# Altium project relay_matrix.PrjPCB (part 2 of 2)

## Sheet drivers.SchDoc
size A4
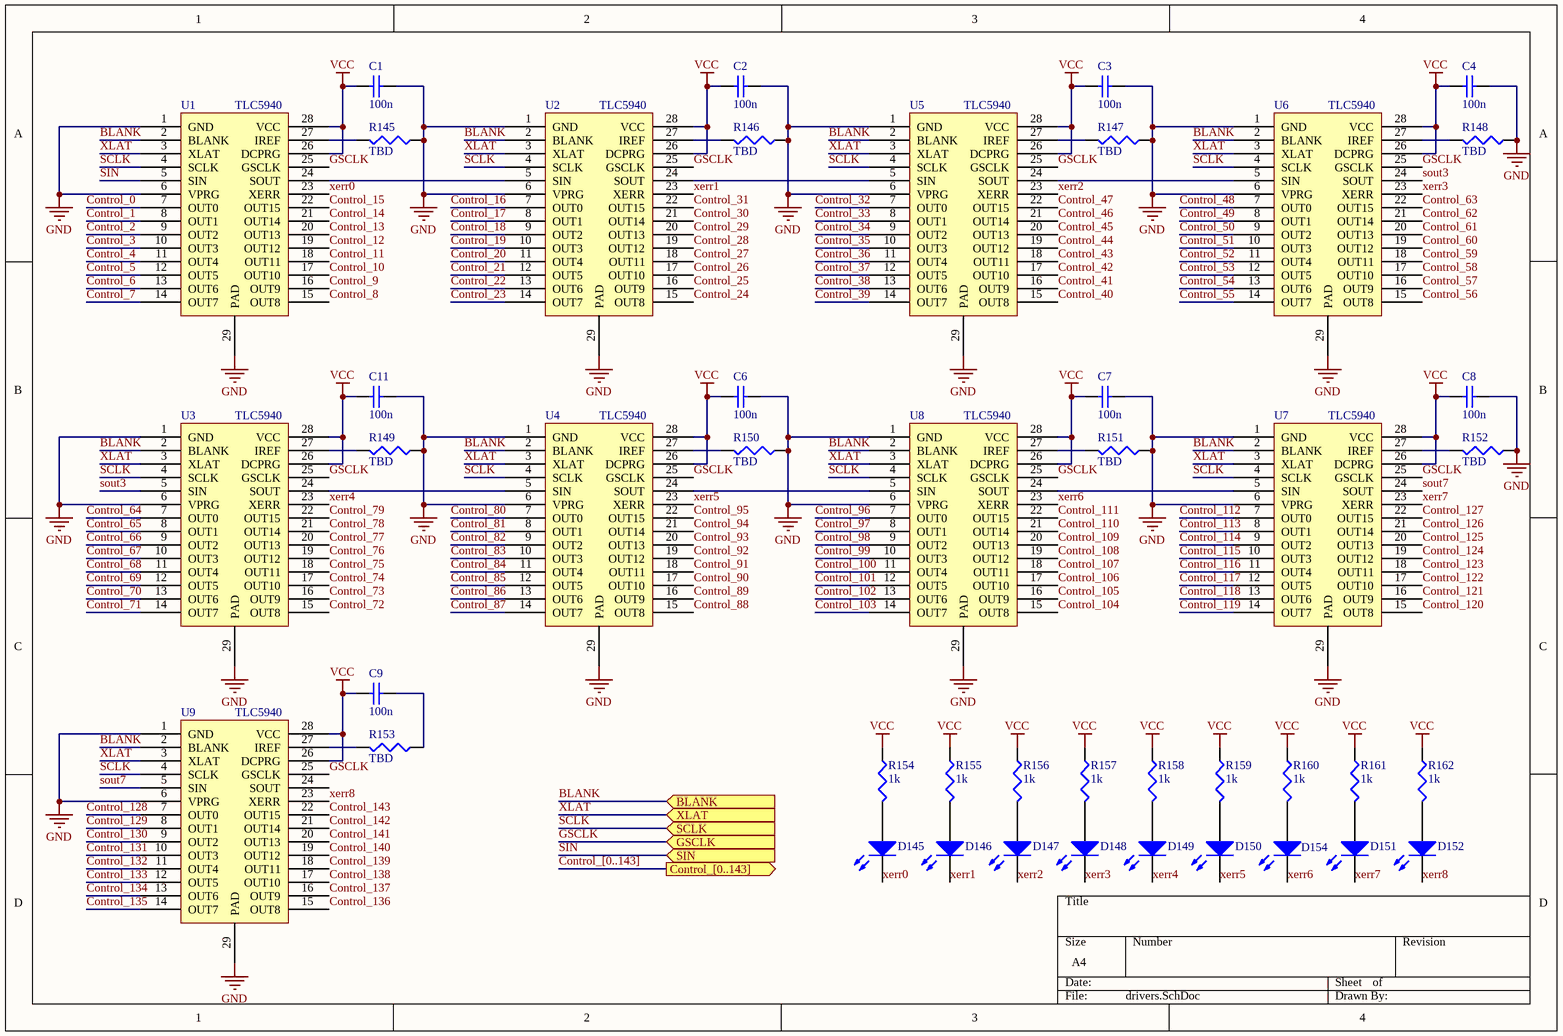
[diagram p5: drivers.SchDoc]

### Parts
C1  value 100n  [1608[0603]]  (hidden comment: Cap Semi)
C2  value 100n  [1608[0603]]  (hidden comment: Cap Semi)
C3  value 100n  [1608[0603]]  (hidden comment: Cap Semi)
C4  value 100n  [1608[0603]]  (hidden comment: Cap Semi)
C6  value 100n  [1608[0603]]  (hidden comment: Cap Semi)
C7  value 100n  [1608[0603]]  (hidden comment: Cap Semi)
C8  value 100n  [1608[0603]]  (hidden comment: Cap Semi)
C9  value 100n  [1608[0603]]  (hidden comment: Cap Semi)
C11  value 100n  [1608[0603]]  (hidden comment: Cap Semi)
D145  LED0  [J1-0603]  (value not drawn)
D146  LED0  [J1-0603]  (value not drawn)
D147  LED0  [J1-0603]  (value not drawn)
D148  LED0  [J1-0603]  (value not drawn)
D149  LED0  [J1-0603]  (value not drawn)
D150  LED0  [J1-0603]  (value not drawn)
D151  LED0  [J1-0603]  (value not drawn)
D152  LED0  [J1-0603]  (value not drawn)
D154  LED0  [J1-0603]  (value not drawn)
R145  value TBD  [J1-0603]  (hidden comment: Res3)
R146  value TBD  [J1-0603]  (hidden comment: Res3)
R147  value TBD  [J1-0603]  (hidden comment: Res3)
R148  value TBD  [J1-0603]  (hidden comment: Res3)
R149  value TBD  [J1-0603]  (hidden comment: Res3)
R150  value TBD  [J1-0603]  (hidden comment: Res3)
R151  value TBD  [J1-0603]  (hidden comment: Res3)
R152  value TBD  [J1-0603]  (hidden comment: Res3)
R153  value TBD  [J1-0603]  (hidden comment: Res3)
R154  value 1k  [J1-0603]  (hidden comment: Res3)
R155  value 1k  [J1-0603]  (hidden comment: Res3)
R156  value 1k  [J1-0603]  (hidden comment: Res3)
R157  value 1k  [J1-0603]  (hidden comment: Res3)
R158  value 1k  [J1-0603]  (hidden comment: Res3)
R159  value 1k  [J1-0603]  (hidden comment: Res3)
R160  value 1k  [J1-0603]  (hidden comment: Res3)
R161  value 1k  [J1-0603]  (hidden comment: Res3)
R162  value 1k  [J1-0603]  (hidden comment: Res3)
U1  TLC5940  [HTSSOP28]
U2  TLC5940  [HTSSOP28]
U3  TLC5940  [HTSSOP28]
U4  TLC5940  [HTSSOP28]
U5  TLC5940  [HTSSOP28]
U6  TLC5940  [HTSSOP28]
U7  TLC5940  [HTSSOP28]
U8  TLC5940  [HTSSOP28]
U9  TLC5940  [HTSSOP28]

### Ports
BLANK (in), Control_[0..143] (out), GSCLK (in), SCLK (in), SIN (in), XLAT (in)

### Nets
GND: C1.1 C2.1 C3.1 C4.1 C6.1 C7.1 C8.1 C11.1 R145.1 R146.1 R147.1 R148.1 R149.1 R150.1 R151.1 R152.1 U1.1(GND) U1.6(VPRG) U1.29(PAD) U2.1(GND) U2.6(VPRG) U2.29(PAD) U3.1(GND) U3.6(VPRG) U3.29(PAD) U4.1(GND) U4.6(VPRG) U4.29(PAD) U5.1(GND) U5.6(VPRG) U5.29(PAD) U6.1(GND) U6.6(VPRG) U6.29(PAD) U7.1(GND) U7.6(VPRG) U7.29(PAD) U8.1(GND) U8.6(VPRG) U8.29(PAD) U9.1(GND) U9.6(VPRG) U9.29(PAD)
VCC: C1.2 C2.2 C3.2 C4.2 C6.2 C7.2 C8.2 C9.2 C11.2 R154.1 R155.1 R156.1 R157.1 R158.1 R159.1 R160.1 R161.1 R162.1 U1.26(DCPRG) U1.28(VCC) U2.26(DCPRG) U2.28(VCC) U3.26(DCPRG) U3.28(VCC) U4.26(DCPRG) U4.28(VCC) U5.26(DCPRG) U5.28(VCC) U6.26(DCPRG) U6.28(VCC) U7.26(DCPRG) U7.28(VCC) U8.26(DCPRG) U8.28(VCC) U9.26(DCPRG) U9.28(VCC)
BLANK: U1.2(BLANK) U2.2(BLANK) U3.2(BLANK) U4.2(BLANK) U5.2(BLANK) U6.2(BLANK) U7.2(BLANK) U8.2(BLANK) U9.2(BLANK) ; port BLANK
Control_0: U1.7(OUT0)
Control_1: U1.8(OUT1)
Control_2: U1.9(OUT2)
Control_3: U1.10(OUT3)
Control_4: U1.11(OUT4)
Control_5: U1.12(OUT5)
Control_6: U1.13(OUT6)
Control_7: U1.14(OUT7)
Control_8: U1.15(OUT8)
Control_9: U1.16(OUT9)
Control_10: U1.17(OUT10)
Control_11: U1.18(OUT11)
Control_12: U1.19(OUT12)
Control_13: U1.20(OUT13)
Control_14: U1.21(OUT14)
Control_15: U1.22(OUT15)
Control_16: U2.7(OUT0)
Control_17: U2.8(OUT1)
Control_18: U2.9(OUT2)
Control_19: U2.10(OUT3)
Control_20: U2.11(OUT4)
Control_21: U2.12(OUT5)
Control_22: U2.13(OUT6)
Control_23: U2.14(OUT7)
Control_24: U2.15(OUT8)
Control_25: U2.16(OUT9)
Control_26: U2.17(OUT10)
Control_27: U2.18(OUT11)
Control_28: U2.19(OUT12)
Control_29: U2.20(OUT13)
Control_30: U2.21(OUT14)
Control_31: U2.22(OUT15)
Control_32: U5.7(OUT0)
Control_33: U5.8(OUT1)
Control_34: U5.9(OUT2)
Control_35: U5.10(OUT3)
Control_36: U5.11(OUT4)
Control_37: U5.12(OUT5)
Control_38: U5.13(OUT6)
Control_39: U5.14(OUT7)
Control_40: U5.15(OUT8)
Control_41: U5.16(OUT9)
Control_42: U5.17(OUT10)
Control_43: U5.18(OUT11)
Control_44: U5.19(OUT12)
Control_45: U5.20(OUT13)
Control_46: U5.21(OUT14)
Control_47: U5.22(OUT15)
Control_48: U6.7(OUT0)
Control_49: U6.8(OUT1)
Control_50: U6.9(OUT2)
Control_51: U6.10(OUT3)
Control_52: U6.11(OUT4)
Control_53: U6.12(OUT5)
Control_54: U6.13(OUT6)
Control_55: U6.14(OUT7)
Control_56: U6.15(OUT8)
Control_57: U6.16(OUT9)
Control_58: U6.17(OUT10)
Control_59: U6.18(OUT11)
Control_60: U6.19(OUT12)
Control_61: U6.20(OUT13)
Control_62: U6.21(OUT14)
Control_63: U6.22(OUT15)
Control_64: U3.7(OUT0)
Control_65: U3.8(OUT1)
Control_66: U3.9(OUT2)
Control_67: U3.10(OUT3)
Control_68: U3.11(OUT4)
Control_69: U3.12(OUT5)
Control_70: U3.13(OUT6)
Control_71: U3.14(OUT7)
Control_72: U3.15(OUT8)
Control_73: U3.16(OUT9)
Control_74: U3.17(OUT10)
Control_75: U3.18(OUT11)
Control_76: U3.19(OUT12)
Control_77: U3.20(OUT13)
Control_78: U3.21(OUT14)
Control_79: U3.22(OUT15)
Control_80: U4.7(OUT0)
Control_81: U4.8(OUT1)
Control_82: U4.9(OUT2)
Control_83: U4.10(OUT3)
Control_84: U4.11(OUT4)
Control_85: U4.12(OUT5)
Control_86: U4.13(OUT6)
Control_87: U4.14(OUT7)
Control_88: U4.15(OUT8)
Control_89: U4.16(OUT9)
Control_90: U4.17(OUT10)
Control_91: U4.18(OUT11)
Control_92: U4.19(OUT12)
Control_93: U4.20(OUT13)
Control_94: U4.21(OUT14)
Control_95: U4.22(OUT15)
Control_96: U8.7(OUT0)
Control_97: U8.8(OUT1)
Control_98: U8.9(OUT2)
Control_99: U8.10(OUT3)
Control_100: U8.11(OUT4)
Control_101: U8.12(OUT5)
Control_102: U8.13(OUT6)
Control_103: U8.14(OUT7)
Control_104: U8.15(OUT8)
Control_105: U8.16(OUT9)
Control_106: U8.17(OUT10)
Control_107: U8.18(OUT11)
Control_108: U8.19(OUT12)
Control_109: U8.20(OUT13)
Control_110: U8.21(OUT14)
Control_111: U8.22(OUT15)
Control_112: U7.7(OUT0)
Control_113: U7.8(OUT1)
Control_114: U7.9(OUT2)
Control_115: U7.10(OUT3)
Control_116: U7.11(OUT4)
Control_117: U7.12(OUT5)
Control_118: U7.13(OUT6)
Control_119: U7.14(OUT7)
Control_120: U7.15(OUT8)
Control_121: U7.16(OUT9)
Control_122: U7.17(OUT10)
Control_123: U7.18(OUT11)
Control_124: U7.19(OUT12)
Control_125: U7.20(OUT13)
Control_126: U7.21(OUT14)
Control_127: U7.22(OUT15)
Control_128: U9.7(OUT0)
Control_129: U9.8(OUT1)
Control_130: U9.9(OUT2)
Control_131: U9.10(OUT3)
Control_132: U9.11(OUT4)
Control_133: U9.12(OUT5)
Control_134: U9.13(OUT6)
Control_135: U9.14(OUT7)
Control_136: U9.15(OUT8)
Control_137: U9.16(OUT9)
Control_138: U9.17(OUT10)
Control_139: U9.18(OUT11)
Control_140: U9.19(OUT12)
Control_141: U9.20(OUT13)
Control_142: U9.21(OUT14)
Control_143: U9.22(OUT15)
GSCLK: U1.25(GSCLK) U2.25(GSCLK) U3.25(GSCLK) U4.25(GSCLK) U5.25(GSCLK) U6.25(GSCLK) U7.25(GSCLK) U8.25(GSCLK) U9.25(GSCLK) ; port GSCLK
SCLK: U1.4(SCLK) U2.4(SCLK) U3.4(SCLK) U4.4(SCLK) U5.4(SCLK) U6.4(SCLK) U7.4(SCLK) U8.4(SCLK) U9.4(SCLK) ; port SCLK
SIN: U1.5(SIN) ; port SIN
sout3: U3.5(SIN) U6.24(SOUT)
sout7: U7.24(SOUT) U9.5(SIN)
xerr0: D145.2(K) U1.23(XERR)
xerr1: D146.2(K) U2.23(XERR)
xerr2: D147.2(K) U5.23(XERR)
xerr3: D148.2(K) U6.23(XERR)
xerr4: D149.2(K) U3.23(XERR)
xerr5: D150.2(K) U4.23(XERR)
xerr6: D154.2(K) U8.23(XERR)
xerr7: D151.2(K) U7.23(XERR)
xerr8: D152.2(K) U9.23(XERR)
XLAT: U1.3(XLAT) U2.3(XLAT) U3.3(XLAT) U4.3(XLAT) U5.3(XLAT) U6.3(XLAT) U7.3(XLAT) U8.3(XLAT) U9.3(XLAT) ; port XLAT
NetC9_1: C9.1 R153.1
NetD145_1: D145.1(A) R154.2
NetD146_1: D146.1(A) R155.2
NetD147_1: D147.1(A) R156.2
NetD148_1: D148.1(A) R157.2
NetD149_1: D149.1(A) R158.2
NetD150_1: D150.1(A) R159.2
NetD151_1: D151.1(A) R161.2
NetD152_1: D152.1(A) R162.2
NetD154_1: D154.1(A) R160.2
NetR145_2: R145.2 U1.27(IREF)
NetR146_2: R146.2 U2.27(IREF)
NetR147_2: R147.2 U5.27(IREF)
NetR148_2: R148.2 U6.27(IREF)
NetR149_2: R149.2 U3.27(IREF)
NetR150_2: R150.2 U4.27(IREF)
NetR151_2: R151.2 U8.27(IREF)
NetR152_2: R152.2 U7.27(IREF)
NetR153_2: R153.2 U9.27(IREF)
NetU1_24: U1.24(SOUT) U2.5(SIN)
NetU2_24: U2.24(SOUT) U5.5(SIN)
NetU3_24: U3.24(SOUT) U4.5(SIN)
NetU4_24: U4.24(SOUT) U8.5(SIN)
NetU5_24: U5.24(SOUT) U6.5(SIN)
NetU7_5: U7.5(SIN) U8.24(SOUT)

Not connected (* = marked no-connect by the designer): U9 24(SOUT)

### Buses and harness runs
bus Control_[0..143] = port Control_[0..143]

### Library data of the parts
C1-C4 C6-C9 C11 = Cap Semi: Capacitor (Semiconductor SIM Model); Published: 8-Jun-2000; LatestRevisionDate: 29-May-2009; LatestRevisionNote: IPC-7351 Footprint Added.; PackageReference: C1206; Publisher: Altium Limited; PackageDescription: Chip Capacitor
D145-D152 D154 = LED0: Typical INFRARED GaAs LED; Published: 8-Jun-2000; LatestRevisionDate: 08-Jul-2005; LatestRevisionNote: Mech Layer 1 removed.; PackageReference: LED-0; Publisher: Altium Limited; PackageDescription: LED; 2 Leads
R145-R162 = Res3: Resistor; Published: 8-Jun-2000; LatestRevisionDate: 29-May-2009; LatestRevisionNote: IPC-7351 Footprint Added.; PackageReference: J1-0603; Publisher: Altium Limited; PackageDescription: Chip Resistor
U1-U9 = TLC5940: 16 CHANNEL LED DRIVER WITH DOT CORRECTION AND GRAYSCALE PWM CONTROL; Part number: 1755256

## Nets that join several sheets
12V: relay_matrix (11 pins), relays0 (72 pins), relays1 (72 pins), relays2 (72 pins), relays3 (72 pins)
GND: relay_matrix (44 pins), drivers (43 pins)
VCC: relay_matrix (15 pins), drivers (36 pins)
Audio_0: relays0 (7 pins), relays1 (6 pins)
Audio_1: relays0 (7 pins), relays1 (6 pins)
Audio_2: relays0 (7 pins), relays1 (6 pins)
Audio_3: relays0 (7 pins), relays1 (6 pins)
Audio_4: relays0 (7 pins), relays1 (6 pins)
Audio_5: relays0 (7 pins), relays1 (6 pins)
Audio_6: relays2 (7 pins), relays3 (6 pins)
Audio_7: relays2 (7 pins), relays3 (6 pins)
Audio_8: relays2 (7 pins), relays3 (6 pins)
Audio_9: relays2 (7 pins), relays3 (6 pins)
Audio_10: relays2 (7 pins), relays3 (6 pins)
Audio_11: relays2 (7 pins), relays3 (6 pins)
BLANK: relay_matrix (U10.14), drivers (9 pins)
Control_0: relays0 (R1.1 RL1.3), drivers (U1.7)
Control_1: relays0 (R2.1 RL2.3), drivers (U1.8)
Control_2: relays0 (R3.1 RL3.3), drivers (U1.9)
Control_3: relays0 (R4.1 RL4.3), drivers (U1.10)
Control_4: relays0 (R5.1 RL5.3), drivers (U1.11)
Control_5: relays0 (R6.1 RL6.3), drivers (U1.12)
Control_6: relays1 (R37.1 RL37.3), drivers (U1.13)
Control_7: relays1 (R38.1 RL38.3), drivers (U1.14)
Control_8: relays1 (R39.1 RL39.3), drivers (U1.15)
Control_9: relays1 (R40.1 RL40.3), drivers (U1.16)
Control_10: relays1 (R41.1 RL41.3), drivers (U1.17)
Control_11: relays1 (R42.1 RL42.3), drivers (U1.18)
Control_12: relays0 (R7.1 RL7.3), drivers (U1.19)
Control_13: relays0 (R8.1 RL8.3), drivers (U1.20)
Control_14: relays0 (R9.1 RL9.3), drivers (U1.21)
Control_15: relays0 (R10.1 RL10.3), drivers (U1.22)
Control_16: relays0 (R11.1 RL11.3), drivers (U2.7)
Control_17: relays0 (R12.1 RL12.3), drivers (U2.8)
Control_18: relays1 (R43.1 RL43.3), drivers (U2.9)
Control_19: relays1 (R44.1 RL44.3), drivers (U2.10)
Control_20: relays1 (R45.1 RL45.3), drivers (U2.11)
Control_21: relays1 (R46.1 RL46.3), drivers (U2.12)
Control_22: relays1 (R47.1 RL47.3), drivers (U2.13)
Control_23: relays1 (R48.1 RL48.3), drivers (U2.14)
Control_24: relays0 (R13.1 RL13.3), drivers (U2.15)
Control_25: relays0 (R14.1 RL14.3), drivers (U2.16)
Control_26: relays0 (R15.1 RL15.3), drivers (U2.17)
Control_27: relays0 (R16.1 RL16.3), drivers (U2.18)
Control_28: relays0 (R17.1 RL17.3), drivers (U2.19)
Control_29: relays0 (R18.1 RL18.3), drivers (U2.20)
Control_30: relays1 (R49.1 RL49.3), drivers (U2.21)
Control_31: relays1 (R50.1 RL50.3), drivers (U2.22)
Control_32: relays1 (R51.1 RL51.3), drivers (U5.7)
Control_33: relays1 (R52.1 RL52.3), drivers (U5.8)
Control_34: relays1 (R53.1 RL53.3), drivers (U5.9)
Control_35: relays1 (R54.1 RL54.3), drivers (U5.10)
Control_36: relays0 (R19.1 RL19.3), drivers (U5.11)
Control_37: relays0 (R20.1 RL20.3), drivers (U5.12)
Control_38: relays0 (R21.1 RL21.3), drivers (U5.13)
Control_39: relays0 (R22.1 RL22.3), drivers (U5.14)
Control_40: relays0 (R23.1 RL23.3), drivers (U5.15)
Control_41: relays0 (R24.1 RL24.3), drivers (U5.16)
Control_42: relays1 (R55.1 RL55.3), drivers (U5.17)
Control_43: relays1 (R56.1 RL56.3), drivers (U5.18)
Control_44: relays1 (R57.1 RL57.3), drivers (U5.19)
Control_45: relays1 (R58.1 RL58.3), drivers (U5.20)
Control_46: relays1 (R59.1 RL59.3), drivers (U5.21)
Control_47: relays1 (R60.1 RL60.3), drivers (U5.22)
Control_48: relays0 (R25.1 RL25.3), drivers (U6.7)
Control_49: relays0 (R26.1 RL26.3), drivers (U6.8)
Control_50: relays0 (R27.1 RL27.3), drivers (U6.9)
Control_51: relays0 (R28.1 RL28.3), drivers (U6.10)
Control_52: relays0 (R29.1 RL29.3), drivers (U6.11)
Control_53: relays0 (R30.1 RL30.3), drivers (U6.12)
Control_54: relays1 (R61.1 RL61.3), drivers (U6.13)
Control_55: relays1 (R62.1 RL62.3), drivers (U6.14)
Control_56: relays1 (R63.1 RL63.3), drivers (U6.15)
Control_57: relays1 (R64.1 RL64.3), drivers (U6.16)
Control_58: relays1 (R65.1 RL65.3), drivers (U6.17)
Control_59: relays1 (R66.1 RL66.3), drivers (U6.18)
Control_60: relays0 (R31.1 RL31.3), drivers (U6.19)
Control_61: relays0 (R32.1 RL32.3), drivers (U6.20)
Control_62: relays0 (R33.1 RL33.3), drivers (U6.21)
Control_63: relays0 (R34.1 RL34.3), drivers (U6.22)
Control_64: relays0 (R35.1 RL35.3), drivers (U3.7)
Control_65: relays0 (R36.1 RL36.3), drivers (U3.8)
Control_66: relays1 (R67.1 RL67.3), drivers (U3.9)
Control_67: relays1 (R68.1 RL68.3), drivers (U3.10)
Control_68: relays1 (R69.1 RL69.3), drivers (U3.11)
Control_69: relays1 (R70.1 RL70.3), drivers (U3.12)
Control_70: relays1 (R71.1 RL71.3), drivers (U3.13)
Control_71: relays1 (R72.1 RL72.3), drivers (U3.14)
Control_72: relays2 (R73.1 RL73.3), drivers (U3.15)
Control_73: relays2 (R74.1 RL74.3), drivers (U3.16)
Control_74: relays2 (R75.1 RL75.3), drivers (U3.17)
Control_75: relays2 (R76.1 RL76.3), drivers (U3.18)
Control_76: relays2 (R77.1 RL77.3), drivers (U3.19)
Control_77: relays2 (R78.1 RL78.3), drivers (U3.20)
Control_78: relays3 (R109.1 RL109.3), drivers (U3.21)
Control_79: relays3 (R110.1 RL110.3), drivers (U3.22)
Control_80: relays3 (R111.1 RL111.3), drivers (U4.7)
Control_81: relays3 (R112.1 RL112.3), drivers (U4.8)
Control_82: relays3 (R113.1 RL113.3), drivers (U4.9)
Control_83: relays3 (R114.1 RL114.3), drivers (U4.10)
Control_84: relays2 (R79.1 RL79.3), drivers (U4.11)
Control_85: relays2 (R80.1 RL80.3), drivers (U4.12)
Control_86: relays2 (R81.1 RL81.3), drivers (U4.13)
Control_87: relays2 (R82.1 RL82.3), drivers (U4.14)
Control_88: relays2 (R83.1 RL83.3), drivers (U4.15)
Control_89: relays2 (R84.1 RL84.3), drivers (U4.16)
Control_90: relays3 (R115.1 RL115.3), drivers (U4.17)
Control_91: relays3 (R116.1 RL116.3), drivers (U4.18)
Control_92: relays3 (R117.1 RL117.3), drivers (U4.19)
Control_93: relays3 (R118.1 RL118.3), drivers (U4.20)
Control_94: relays3 (R119.1 RL119.3), drivers (U4.21)
Control_95: relays3 (R120.1 RL120.3), drivers (U4.22)
Control_96: relays2 (R85.1 RL85.3), drivers (U8.7)
Control_97: relays2 (R86.1 RL86.3), drivers (U8.8)
Control_98: relays2 (R87.1 RL87.3), drivers (U8.9)
Control_99: relays2 (R88.1 RL88.3), drivers (U8.10)
Control_100: relays2 (R89.1 RL89.3), drivers (U8.11)
Control_101: relays2 (R90.1 RL90.3), drivers (U8.12)
Control_102: relays3 (R121.1 RL121.3), drivers (U8.13)
Control_103: relays3 (R122.1 RL122.3), drivers (U8.14)
Control_104: relays3 (R123.1 RL123.3), drivers (U8.15)
Control_105: relays3 (R124.1 RL124.3), drivers (U8.16)
Control_106: relays3 (R125.1 RL125.3), drivers (U8.17)
Control_107: relays3 (R126.1 RL126.3), drivers (U8.18)
Control_108: relays2 (R91.1 RL91.3), drivers (U8.19)
Control_109: relays2 (R92.1 RL92.3), drivers (U8.20)
Control_110: relays2 (R93.1 RL93.3), drivers (U8.21)
Control_111: relays2 (R94.1 RL94.3), drivers (U8.22)
Control_112: relays2 (R95.1 RL95.3), drivers (U7.7)
Control_113: relays2 (R96.1 RL96.3), drivers (U7.8)
Control_114: relays3 (R127.1 RL127.3), drivers (U7.9)
Control_115: relays3 (R128.1 RL128.3), drivers (U7.10)
Control_116: relays3 (R129.1 RL129.3), drivers (U7.11)
Control_117: relays3 (R130.1 RL130.3), drivers (U7.12)
Control_118: relays3 (R131.1 RL131.3), drivers (U7.13)
Control_119: relays3 (R132.1 RL132.3), drivers (U7.14)
Control_120: relays2 (R97.1 RL97.3), drivers (U7.15)
Control_121: relays2 (R98.1 RL98.3), drivers (U7.16)
Control_122: relays2 (R99.1 RL99.3), drivers (U7.17)
Control_123: relays2 (R100.1 RL100.3), drivers (U7.18)
Control_124: relays2 (R101.1 RL101.3), drivers (U7.19)
Control_125: relays2 (R102.1 RL102.3), drivers (U7.20)
Control_126: relays3 (R133.1 RL133.3), drivers (U7.21)
Control_127: relays3 (R134.1 RL134.3), drivers (U7.22)
Control_128: relays3 (R135.1 RL135.3), drivers (U9.7)
Control_129: relays3 (R136.1 RL136.3), drivers (U9.8)
Control_130: relays3 (R137.1 RL137.3), drivers (U9.9)
Control_131: relays3 (R138.1 RL138.3), drivers (U9.10)
Control_132: relays2 (R103.1 RL103.3), drivers (U9.11)
Control_133: relays2 (R104.1 RL104.3), drivers (U9.12)
Control_134: relays2 (R105.1 RL105.3), drivers (U9.13)
Control_135: relays2 (R106.1 RL106.3), drivers (U9.14)
Control_136: relays2 (R107.1 RL107.3), drivers (U9.15)
Control_137: relays2 (R108.1 RL108.3), drivers (U9.16)
Control_138: relays3 (R139.1 RL139.3), drivers (U9.17)
Control_139: relays3 (R140.1 RL140.3), drivers (U9.18)
Control_140: relays3 (R141.1 RL141.3), drivers (U9.19)
Control_141: relays3 (R142.1 RL142.3), drivers (U9.20)
Control_142: relays3 (R143.1 RL143.3), drivers (U9.21)
Control_143: relays3 (R144.1 RL144.3), drivers (U9.22)
GSCLK: relay_matrix (U10.1), drivers (9 pins)
NetJ1_1: relays0 (7 pins), relays2 (6 pins)
NetJ2_1: relays0 (7 pins), relays2 (6 pins)
NetJ3_1: relays0 (7 pins), relays2 (6 pins)
NetJ4_1: relays0 (7 pins), relays2 (6 pins)
NetJ5_1: relays0 (7 pins), relays2 (6 pins)
NetJ6_1: relays0 (7 pins), relays2 (6 pins)
NetJ13_1: relays1 (7 pins), relays3 (6 pins)
NetJ14_1: relays1 (7 pins), relays3 (6 pins)
NetJ15_1: relays1 (7 pins), relays3 (6 pins)
NetJ16_1: relays1 (7 pins), relays3 (6 pins)
NetJ17_1: relays1 (7 pins), relays3 (6 pins)
NetJ18_1: relays1 (7 pins), relays3 (6 pins)
SCLK: relay_matrix (P2.3 R166.2 U10.17), drivers (9 pins)
SIN: relay_matrix (P2.4 R167.2 U10.15), drivers (U1.5)
XLAT: relay_matrix (U10.13), drivers (9 pins)